# EAGLE design Ground Station 2019-2020 (EAGLE 9.1.3)
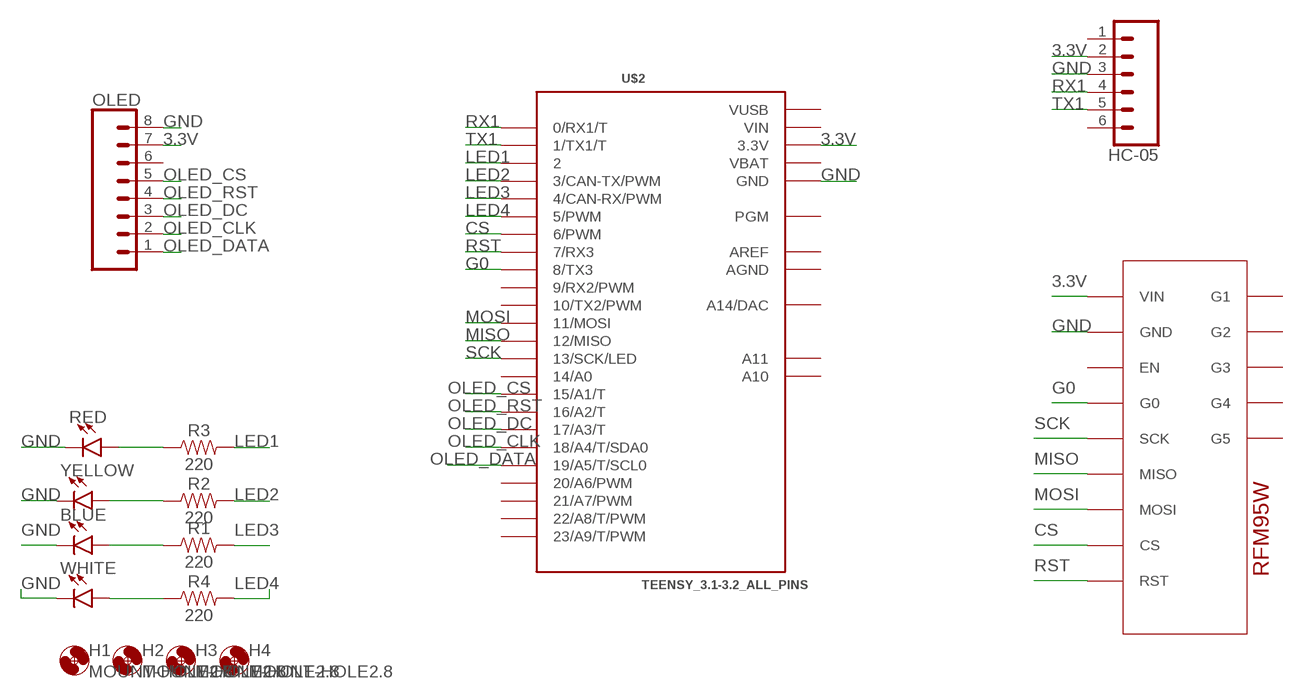
[diagram p0: schematic, sheet 1]

## Parts
BLUE  LED5MM  [LED_5MM]
H1  MOUNT-HOLE2.8  [2,8]
H2  MOUNT-HOLE2.8  [2,8]
H3  MOUNT-HOLE2.8  [2,8]
H4  MOUNT-HOLE2.8  [2,8]
HC-05  CONN_06SILK_FEMALE_PTH  [1X06]
OLED  CONN_08"  [1X08]
R1  220  330OHM-HORIZ-1/10W-5%  [AXIAL-0.3]
R2  220  330OHM-HORIZ-1/10W-5%  [AXIAL-0.3]
R3  220  330OHM-HORIZ-1/10W-5%  [AXIAL-0.3]
R4  220  330OHM-HORIZ-1/10W-5%  [AXIAL-0.3]
RED  LED5MM  [LED_5MM]
U1  ADAFRUIT_RFM95W_LORA_RADIO  [ADAFRUIT_RFM95W_LORA_RADIO]
U$2  TEENSY_3.1-3.2_ALL_PINS  [TEENSY_3.0-3.2&LC_ALL_PINS]
WHITE  LED5MM  [LED_5MM]
YELLOW  LED5MM  [LED_5MM]

## Nets
3.3V: HC-05.2 OLED.7 U1.1(VIN) U$2.3.3V U$2.3.3V1(3.3V)
CS: U1.8(CS) U$2.6(6/PWM)
G0: U1.4(G0) U$2.8(8/TX3)
GND: BLUE.K(C) HC-05.3 OLED.8 RED.K(C) U1.2(GND) U$2.GND U$2.GND1(GND) WHITE.K(C) YELLOW.K(C)
LED1: R3.P$2 U$2.2
LED2: R2.P$2 U$2.3(3/CAN-TX/PWM)
LED3: R1.P$2 U$2.4(4/CAN-RX/PWM)
LED4: R4.P$2 U$2.5(5/PWM)
MISO: U1.6(MISO) U$2.12(12/MISO)
MOSI: U1.7(MOSI) U$2.11(11/MOSI)
N$1: BLUE.A R1.P$1
N$2: R2.P$1 YELLOW.A
N$3: R3.P$1 RED.A
N$5: R4.P$1 WHITE.A
OLED_CLK: OLED.2 U$2.18/A4(18/A4/T/SDA0)
OLED_CS: OLED.5 U$2.15/A1(15/A1/T)
OLED_DATA: OLED.1 U$2.19/A5(19/A5/T/SCL0)
OLED_DC: OLED.3 U$2.17/A3(17/A3/T)
OLED_RST: OLED.4 U$2.16/A2(16/A2/T)
RST: U1.9(RST) U$2.7(7/RX3)
RX1: HC-05.4 U$2.0(0/RX1/T)
SCK: U1.5(SCK) U$2.13(13/SCK/LED)
TX1: HC-05.5 U$2.1(1/TX1/T)
Unconnected: HC-05.1 HC-05.6 OLED.6 U1.3(EN) U1.10(G1) U1.11(G2) U1.12(G3) U1.13(G4) U1.14(G5) U$2.9(9/RX2/PWM) U$2.10(10/TX2/PWM) U$2.14/A0 U$2.20/A6(20/A6/PWM) U$2.21/A7(21/A7/PWM) U$2.22/A8(22/A8/T/PWM) U$2.23/A9(23/A9/T/PWM) U$2.A10 U$2.A11 U$2.PGM U$2.RESET/DAC(A14/DAC)

## Power pins joined to a net without a drawn wire
AGND: U$2.AGND
AREF: U$2.AREF
VBAT: U$2.VBAT
VIN: U$2.VIN
VUSB: U$2.VUSB

## Library data of the parts
BLUE RED WHITE YELLOW = SparkFun-LED:LED: LED (Generic) Standard schematic elements and footprints for 5mm, 3mm, 1206, and 0603 sized LEDs. Generic LEDs with no color specified.
H1-H4 = holes:MOUNT-HOLE: MOUNTING HOLE with drill center marker
HC-05 = SparkFun-Connectors:CONN_06: Multi connection point. Often used as Generic Header-pin footprint for 0.1 inch spaced/style header connections On any of the 0.1 inch spaced packages, you can populate with these: Break Away Headers - Straight <https://www.sparkfun.com/products/116> (PRT-00116) Break Away Male Headers - Right Angle <https://www.sparkfun.com/products/553> (PRT-00553) Female Headers <https://www.sparkfun.com/products/115> (PRT-00115) Break Away Headers - Machine Pin <https://www.sparkfun.com/products/117> (PRT-00117) Break Away Female Headers - Swiss Machine Pin <https://www.sparkfun.com/products/743> (PRT-00743) Arduino Stackable Header - 6 Pin <https://www.sparkfun.com/products/9280> (PRT-09280) For SCREWTERMINALS and SPRING TERMINALS visit here: Screw Terimnals on SparkFun.com <https://www.sparkfun.com/search/results?term=Screw+Terminals> (5mm/3.5mm/2.54mm spacing) This device is also useful as a general connection point to wire up your design to another part of your project. Our various solder wires solder well into these plated through hole pads. Hook-Up Wire - Assortment (Stranded, 22 AWG) <https://www.sparkfun.com/products/11375> (PRT-11375) Hook-Up Wire - Assortment (Solid Core, 22 AWG) <https://www.sparkfun.com/products/11367> (PRT-11367) View the entire wire category on our website here <https://www.sparkfun.com/categories/141>; PROD_ID: CONN-08437
OLED = SparkFun-Connectors:CONN_08: Multi connection point. Often used as Generic Header-pin footprint for 0.1 inch spaced/style header connections On any of the 0.1 inch spaced packages, you can populate with these: Break Away Headers - Straight <https://www.sparkfun.com/products/116> (PRT-00116) Break Away Male Headers - Right Angle <https://www.sparkfun.com/products/553> (PRT-00553) Female Headers <https://www.sparkfun.com/products/115> (PRT-00115) Break Away Headers - Machine Pin <https://www.sparkfun.com/products/117> (PRT-00117) Break Away Female Headers - Swiss Machine Pin <https://www.sparkfun.com/products/743> (PRT-00743) Arduino Stackable Header - 8 Pin <https://www.sparkfun.com/products/9279> (PRT-09279) For SCREWTERMINALS and SPRING TERMINALS visit here: Screw Terimnals on SparkFun.com <https://www.sparkfun.com/search/results?term=Screw+Terminals> (5mm/3.5mm/2.54mm spacing) This device is also useful as a general connection point to wire up your design to another part of your project. Our various solder wires solder well into these plated through hole pads. Hook-Up Wire - Assortment (Stranded, 22 AWG) <https://www.sparkfun.com/products/11375> (PRT-11375) Hook-Up Wire - Assortment (Solid Core, 22 AWG) <https://www.sparkfun.com/products/11367> (PRT-11367) View the entire wire category on our website here <https://www.sparkfun.com/categories/141> Special notes: Molex polarized connector foot print use with SKU : PRT-08231 with associated crimp pins and housings. 1MM SMD Version SKU: PRT-10208 NOTES ON THE VARIANTS LOCK and LOCK_LONGPADS... This footprint was designed to help hold the alignment of a through-hole component (i.e. 6-pin header) while soldering it into place. You may notice that each hole has been shifted either up or down by 0.005 of an inch from it's more standard position (which is a perfectly straight line). This slight alteration caused the pins (the squares in the middle) to touch the edges of the holes. Because they are alternating, it causes a "brace" to hold the component in place. 0.005 has proven to be the perfect amount of "off-center" position when using our standard breakaway headers. Although looks a little odd when you look at the bare footprint, once you have a header in there, the alteration is very hard to notice. Also,if you push a header all the way into place, it is covered up entirely on the bottom side.; PROD_ID: CONN-08438
R1-R4 = SparkFun-Resistors:330OHM: 330Ω resistor A resistor is a passive two-terminal electrical component that implements electrical resistance as a circuit element. Resistors act to reduce current flow, and, at the same time, act to lower voltage levels within circuits. - Wikipedia; PROD_ID: RES-8371; VALUE: 330
U1 = AERO_Eagle_Library:ADAFRUIT_RFM95W_LORA_RADIO: Adafruit's LoRa Radio: RFM95W https://www.adafruit.com/product/3072
U$2 = Teensy_3_and_LC_Series_Boards_v1.4:TEENSY_3.1-3.2_ALL_PINS: Footprint for Teensy 3.1 or 3.2 board using all through-holes, i.e. the entire perimeter plus the 4 through-holes inboard (A10,A11,AREF, VUSB)

## Board
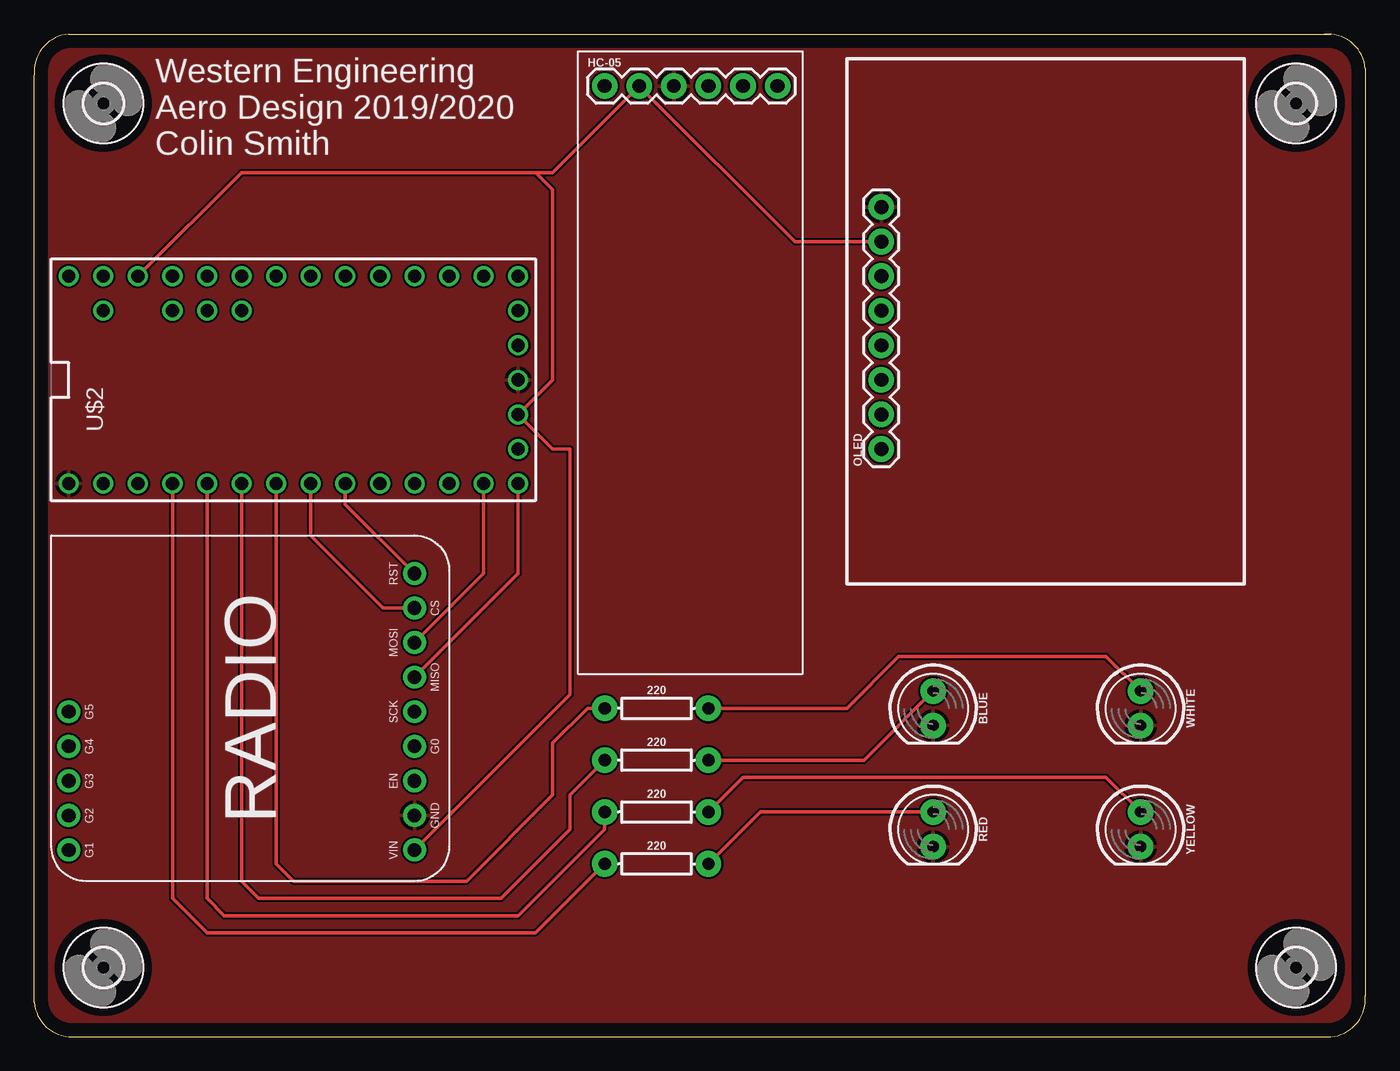
[diagram p1: board, top side]
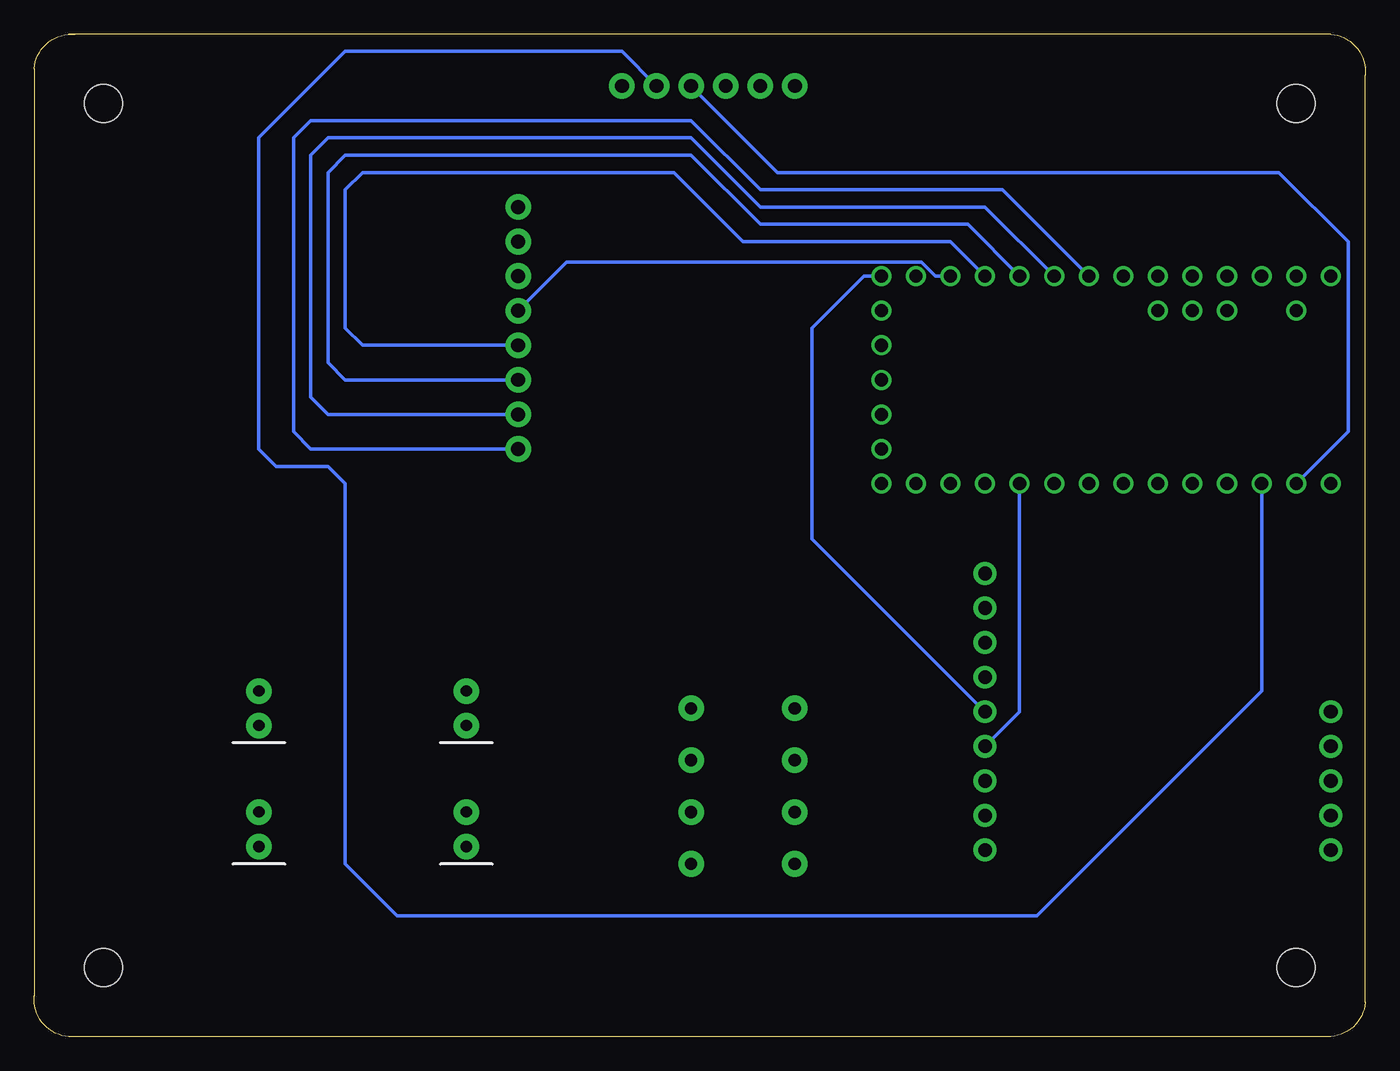
[diagram p2: board, bottom side, seen from below]

Size 97.81 x 73.68 mm. Coordinates in mm from the lower left corner, seen from the top.
Outline: 94.8,73.67 2.55,73.67 arc90 0.01,70.67 0.01,2.55 arc81 2.55,0.01
Outline: 94.8,73.67 95.26,73.67
Outline: 94.8,73.67 arc-90 97.8,71.13 97.8,3.01 arc-90 95.26,0.01 2.55,0.01
Outline: 2.55,0.01 arc9 3.01,0.01
Copper layers (1*16): Top 0.035mm / dielectric 1.5mm / Bottom 0.035mm
Design rules "default": minimum track width 6mil, minimum drill 0.35mm, track to track 6mil, track to pad 6mil, pad to pad 6mil, via to via 6mil, smd to smd 6mil, copper to edge 40mil, drill to drill 6mil, minimum pad ring 10mil, minimum via ring 8mil, stop-mask expansion 4mil, vias tented up to drill 0mil, thermal gap 10mil

### Footprints (pad centres in the part's own frame; a part is rotated, then mirrored left to right if it is on the bottom)
LED_5MM = drill 0.813 pad 1.88: A -1.27,0; K 1.27,0
2,8 = hole 2.8: 0,0
1X06 = drill 1.016 pad 1.88: 1 0,0; 2 2.54,0; 3 5.08,0; 4 7.62,0; 5 10.16,0; 6 12.7,0
1X08 = drill 1.016 pad 1.88: 1 0,0; 2 2.54,0; 3 5.08,0; 4 7.62,0; 5 10.16,0; 6 12.7,0; 7 15.24,0; 8 17.78,0
AXIAL-0.3 = drill 0.9 pad 1.88: P$1 -3.81,0; P$2 3.81,0
ADAFRUIT_RFM95W_LORA_RADIO = drill 1 pad 1.676: 1 2.29,-26.67; 2 4.83,-26.67; 3 7.37,-26.67; 4 9.91,-26.67; 5 12.45,-26.67; 6 14.99,-26.67; 7 17.53,-26.67; 8 20.07,-26.67; 9 22.61,-26.67; 10 2.29,-1.27; 11 4.83,-1.27; 12 7.37,-1.27; 13 9.91,-1.27; 14 12.45,-1.27
TEENSY_3.0-3.2&LC_ALL_PINS = drill 0.965: 0 -7.62,13.97; 1 -7.62,11.43; 2 -7.62,8.89; 3 -7.62,6.35; 3.3V 7.62,11.43; 3.3V1 -2.54,-16.51; 4 -7.62,3.81; 5 -7.62,1.27; 6 -7.62,-1.27; 7 -7.62,-3.81; 8 -7.62,-6.35; 9 -7.62,-8.89; 10 -7.62,-11.43; 11 -7.62,-13.97; 12 -7.62,-16.51; 13 7.62,-16.51; 14/A0 7.62,-13.97; 15/A1 7.62,-11.43; 16/A2 7.62,-8.89; 17/A3 7.62,-6.35; 18/A4 7.62,-3.81; 19/A5 7.62,-1.27; 20/A6 7.62,1.27; 21/A7 7.62,3.81; 22/A8 7.62,6.35; 23/A9 7.62,8.89; A10 5.08,6.35; A11 5.08,3.81; AGND 7.62,13.97; AREF 5.08,8.89; GND -7.62,16.51; GND1 0,-16.51; PGM 2.54,-16.51; RESET/DAC 5.08,-16.51; VBAT -5.08,-16.51; VIN 7.62,16.51; VUSB 5.08,13.97

### Placement (x,y rotation side)
BLUE  66.05,24.14 270 top
H1  5.09,68.59 0 top
H2  92.72,68.59 0 top
H3  92.72,5.09 0 top
H4  5.09,5.09 0 top
HC-05  41.92,69.86 0 top
OLED  62.24,43.19 90 top
R1  45.73,20.33 180 top
R2  45.73,16.52 180 top
R3  45.73,12.71 180 top
R4  45.73,24.14 180 top
RED  66.05,15.25 270 top
U1  1.28,11.44 90 top
U$2  19.06,48.27 90 top
WHITE  81.29,24.14 270 top
YELLOW  81.29,15.25 270 top

### Tracks (layer width: path | path; a pad name or v marks a point on that pad's centre or on a via)
3.3V
  Top 0.254: U$2.3.3V 15.25,63.51 36.84,63.51 | 36.84,63.51 38.11,63.51 HC-05.2 55.89,58.43 OLED.7 | 36.84,63.51 38.11,62.24 38.11,48.27 U$2.3.3V1 38.11,43.19 39.38,43.19 39.38,25.16 U1.1
CS
  Top 0.254: U1.8 25.66,31.51 20.33,36.84 U$2.6
G0
  Bottom 0.254: U1.4 25.41,23.89 U$2.8
GND
  pour Top: -1.26,74.94 99.07,74.94 99.07,-1.26 -1.26,-1.26
LED1
  Top 0.254: U$2.2 10.17,15.25 10.17,10.17 12.71,7.63 36.84,7.63 R3.P$2
LED2
  Top 0.254: U$2.3 12.71,10.17 13.98,8.9 35.57,8.9 41.92,15.25 R2.P$2
LED3
  Top 0.254: U$2.4 15.25,11.44 16.52,10.17 34.3,10.17 39.38,15.25 39.38,17.79 R1.P$2
LED4
  Top 0.254: U$2.5 17.79,12.71 19.06,11.44 31.76,11.44 38.11,17.79 38.11,21.6 40.65,24.14 R4.P$2
MISO
  Top 0.254: U1.6 35.57,34.05 U$2.12
MOSI
  Top 0.254: U1.7 33.03,34.05 U$2.11
N$1
  Top 0.254: R1.P$1 60.97,20.33 BLUE.A
N$2
  Top 0.254: R2.P$1 52.08,19.06 78.75,19.06 YELLOW.A
N$3
  Top 0.254: R3.P$1 53.35,16.52 RED.A
N$5
  Top 0.254: R4.P$1 59.7,24.14 63.51,27.95 78.75,27.95 WHITE.A
OLED_CLK
  Bottom 0.254: U$2.18/A4 27.95,60.97 44.46,60.97 49.54,66.05 76.21,66.05 77.48,64.78 77.48,47 76.21,45.73 OLED.2
OLED_CS
  Bottom 0.254: U$2.15/A1 31.59,55.89 32.61,56.9 58.68,56.9 OLED.5
OLED_DATA
  Bottom 0.254: U$2.19/A5 26.68,62.24 44.46,62.24 49.54,67.32 77.48,67.32 78.75,66.05 78.75,44.46 77.48,43.19 OLED.1
OLED_DC
  Bottom 0.254: U$2.17/A3 29.22,59.7 44.46,59.7 49.54,64.78 74.94,64.78 76.21,63.51 76.21,49.54 74.94,48.27 OLED.3
OLED_RST
  Bottom 0.254: U$2.16/A2 30.49,58.43 44.46,58.43 45.73,58.43 50.81,63.51 73.67,63.51 74.94,62.24 74.94,52.08 73.67,50.81 OLED.4
RST
  Top 0.254: U1.9 22.87,39.13 U$2.7
RX1
  Bottom 0.254: HC-05.4 43.19,63.51 6.36,63.51 1.28,58.43 1.28,44.46 U$2.0
SCK
  Bottom 0.254: U1.5 40.65,36.59 40.65,52.08 36.84,55.89 U$2.13
TX1
  Bottom 0.254: U$2.1 7.63,25.41 24.14,8.9 71.13,8.9 74.94,12.71 74.94,40.65 76.21,41.92 80.02,41.92 81.29,43.19 81.29,66.05 74.94,72.4 54.62,72.4 HC-05.5

### Text on the board
tPlace: Western Engineering / Aero Design 2019/2020 / Colin Smith